# Altium schematic sheet 5_Keyboard.SchDoc
size A4
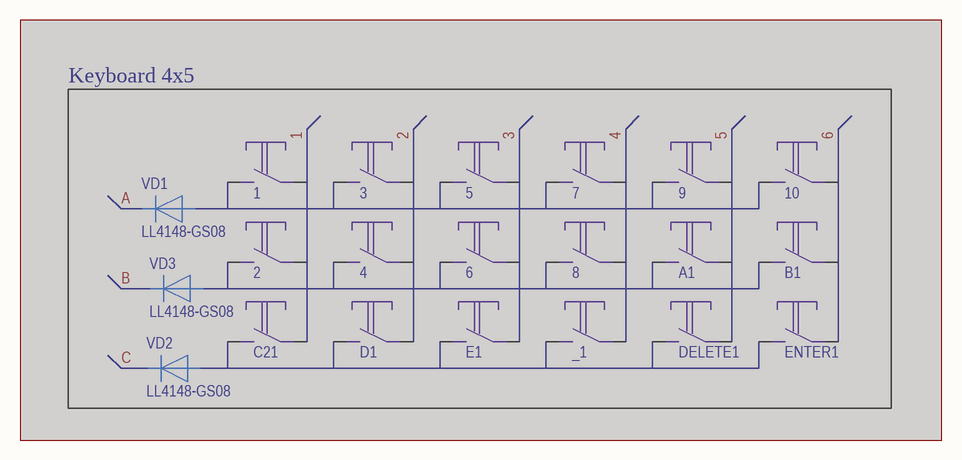
[diagram p0: 5_Keyboard.SchDoc]

## Parts
1  KLS7-TS6601  [KLS7-TS6601]  (value not drawn)  (masked out: inside a compile mask, not in the netlist)
2  KLS7-TS6601  [KLS7-TS6601]  (value not drawn)  (masked out: inside a compile mask, not in the netlist)
3  KLS7-TS6601  [KLS7-TS6601]  (value not drawn)  (masked out: inside a compile mask, not in the netlist)
4  KLS7-TS6601  [KLS7-TS6601]  (value not drawn)  (masked out: inside a compile mask, not in the netlist)
5  KLS7-TS6601  [KLS7-TS6601]  (value not drawn)  (masked out: inside a compile mask, not in the netlist)
6  KLS7-TS6601  [KLS7-TS6601]  (value not drawn)  (masked out: inside a compile mask, not in the netlist)
7  KLS7-TS6601  [KLS7-TS6601]  (value not drawn)  (masked out: inside a compile mask, not in the netlist)
8  KLS7-TS6601  [KLS7-TS6601]  (value not drawn)  (masked out: inside a compile mask, not in the netlist)
9  KLS7-TS6601  [KLS7-TS6601]  (value not drawn)  (masked out: inside a compile mask, not in the netlist)
10  KLS7-TS6601  [KLS7-TS6601]  (value not drawn)  (masked out: inside a compile mask, not in the netlist)
_1  KLS7-TS6601  [KLS7-TS6601]  (value not drawn)  (masked out: inside a compile mask, not in the netlist)
A1  KLS7-TS6601  [KLS7-TS6601]  (value not drawn)  (masked out: inside a compile mask, not in the netlist)
B1  KLS7-TS6601  [KLS7-TS6601]  (value not drawn)  (masked out: inside a compile mask, not in the netlist)
C21  KLS7-TS6601  [KLS7-TS6601]  (value not drawn)  (masked out: inside a compile mask, not in the netlist)
D1  KLS7-TS6601  [KLS7-TS6601]  (value not drawn)  (masked out: inside a compile mask, not in the netlist)
DELETE1  KLS7-TS6601  [KLS7-TS6601]  (value not drawn)  (masked out: inside a compile mask, not in the netlist)
E1  KLS7-TS6601  [KLS7-TS6601]  (value not drawn)  (masked out: inside a compile mask, not in the netlist)
ENTER1  KLS7-TS6601  [KLS7-TS6601]  (value not drawn)  (masked out: inside a compile mask, not in the netlist)
VD1  LL4148-GS08  [SOD-80]  (masked out: inside a compile mask, not in the netlist)
VD2  LL4148-GS08  [SOD-80]  (masked out: inside a compile mask, not in the netlist)
VD3  LL4148-GS08  [SOD-80]  (masked out: inside a compile mask, not in the netlist)

## Blocks framed on the sheet
Keyboard 4x5: 1-10 _1 A1 B1 C21 D1 DELETE1 E1 ENTER1 VD1-VD3

## Library data of the parts
VD1-VD3 = LL4148-GS08: Диод